# Altium schematic sheet POWER.SchDoc
size 594 x 420 mm; SheetNumber: 2; SheetTotal: 20
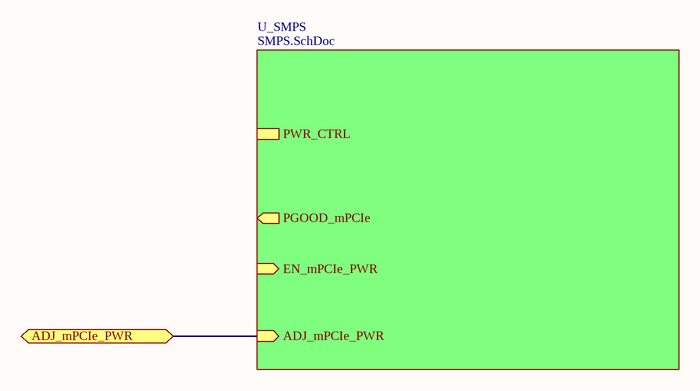
[diagram p0: POWER.SchDoc]

## Sub-sheets
U_SMPS = SMPS.SchDoc: PWR_CTRL (harness PWR_CTRL), PGOOD_mPCIe (out), EN_mPCIe_PWR (in), ADJ_mPCIe_PWR (in)

## Ports
ADJ_mPCIe_PWR (bidir)

## Nets
ADJ_mPCIe_PWR: port ADJ_mPCIe_PWR, sheet U_SMPS/ADJ_mPCIe_PWR

## Notes on the sheet
- DWG NO:
- REV:
- THIS DOCUMENT AND THE DATA DISCLOSED HEREIN OR
- HEREWITH IS THE PROPERTY OF ALTIUM LIMITED AND MAY
- BE FREELY DISTRIBUTED IN WHOLE. NO RIGHTS ARE
- RESERVED OR EXPRESS OR IMPLIED WARANTEE GIVEN.
- REVISION
- DESCRIPTION
- DATE
- APPROVED
- ENG:
- APPROVALS
- PROJECT
- DSN:
- CHK:
- REFERENCE DOCUMENTS
- PROJECT REVISION:
- TITLE
- DOCUMENT REVISION:
- DESIGN ITEM:
- BOM:
- FAB DWG:
- PCB DWG:
- ASSY DWG:
- SCALE:
- A2
- SIZE
- CAGE CODE
- FILE NAME
- DWG NO.
- SHEET
- OF
- REV